# EAGLE board Adapter (EAGLE 6.4)
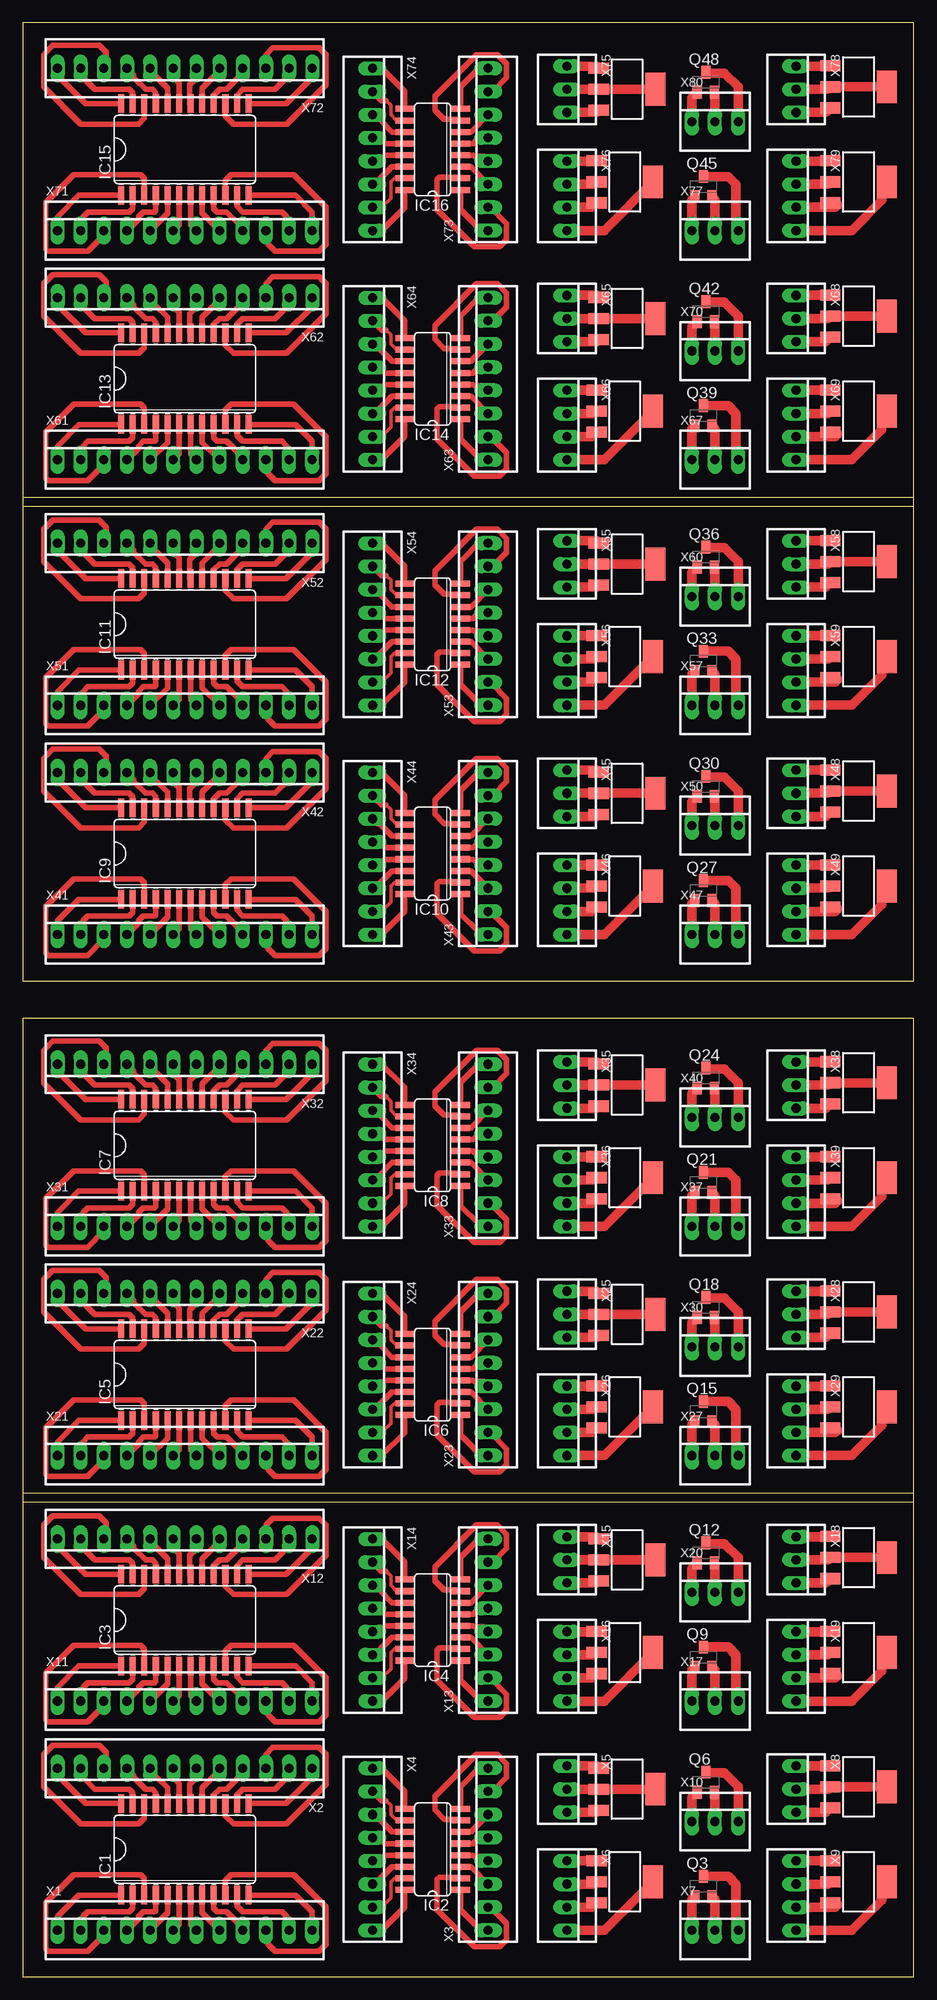
[diagram p8: board, top side]

Size 97.77 x 214.3 mm. Coordinates in mm from the lower left corner, seen from the top.
Outline: 0,0 97.77,0 97.77,53.01 0,53.01 0,0
Outline: 0,52.07 97.77,52.07 97.77,105.08 0,105.08 0,52.07
Outline: 0,109.22 97.77,109.22 97.77,162.23 0,162.23 0,109.22
Outline: 0,161.29 97.77,161.29 97.77,214.3 0,214.3 0,161.29
Copper layers (1*16): Top 0.035mm / dielectric 1.5mm / Bottom 0.035mm
Design rules "default": minimum track width 10mil, minimum drill 24mil, track to track 8mil, track to pad 8mil, pad to pad 8mil, via to via 8mil, smd to smd 8mil, copper to edge 40mil, drill to drill 8mil, minimum pad ring 10mil, minimum via ring 8mil, stop-mask expansion 4mil, vias tented up to drill 0mil, thermal gap 10mil

## Footprints (pad centres in the part's own frame; a part is rotated, then mirrored left to right if it is on the bottom)
SO24W = smd 0.66 x 2.032: 1 -6.985,-5.029; 2 -5.715,-5.029; 3 -4.445,-5.029; 4 -3.175,-5.029; 5 -1.905,-5.029; 6 -0.635,-5.029; 7 0.635,-5.029; 8 1.905,-5.029; 9 3.175,-5.029; 10 4.445,-5.029; 11 5.715,-5.029; 12 6.985,-5.029; 13 6.985,5.029; 14 5.715,5.029; 15 4.445,5.029; 16 3.175,5.029; 17 1.905,5.029; 18 0.635,5.029; 19 -0.635,5.029; 20 -1.905,5.029; 21 -3.175,5.029; 22 -4.445,5.029; 23 -5.715,5.029; 24 -6.985,5.029
SO16 = smd 0.66 x 2.032: 1 -4.445,-3.073; 2 -3.175,-3.073; 3 -1.905,-3.073; 4 -0.635,-3.073; 5 0.635,-3.073; 6 1.905,-3.073; 7 3.175,-3.073; 8 4.445,-3.073; 9 4.445,3.073; 10 3.175,3.073; 11 1.905,3.073; 12 0.635,3.073; 13 -0.635,3.073; 14 -1.905,3.073; 15 -3.175,3.073; 16 -4.445,3.073
SOT223 = smd 1.219 x 2.235: 1 -2.311,-3.099; 2 0,-3.099; 3 2.311,-3.099 | smd 3.6 x 2.2: 4 0,3.099
SOT23-BEC = smd 1 x 1.4: B -0.95,-1.1; C 0,1.1; E 0.95,-1.1
22-23-2121 = drill 1 long: 1 -13.97,0; 2 -11.43,0; 3 -8.89,0; 4 -6.35,0; 5 -3.81,0; 6 -1.27,0; 7 1.27,0; 8 3.81,0; 9 6.35,0; 10 8.89,0; 11 11.43,0; 12 13.97,0
22-23-2081 = drill 1 long: 1 -8.89,0; 2 -6.35,0; 3 -3.81,0; 4 -1.27,0; 5 1.27,0; 6 3.81,0; 7 6.35,0; 8 8.89,0
22-23-2031 = drill 1 long: 1 -2.54,0; 2 0,0; 3 2.54,0
22-23-2041 = drill 1 long: 1 -3.81,0; 2 -1.27,0; 3 1.27,0; 4 3.81,0

## Placement (x,y rotation side)
IC1  4067D  [SO24W]  17.78,13.97 0 top
IC2  ULN2004AD  [SO16]  44.96,13.97 90 top
IC3  4067D  [SO24W]  17.78,39.12 0 top
IC4  ULN2004AD  [SO16]  44.96,39.12 90 top
IC5  4067D  [SO24W]  17.78,66.04 0 top
IC6  ULN2004AD  [SO16]  44.96,66.04 90 top
IC7  4067D  [SO24W]  17.78,91.19 0 top
IC8  ULN2004AD  [SO16]  44.96,91.19 90 top
IC9  4067D  [SO24W]  17.78,123.19 0 top
IC10  ULN2004AD  [SO16]  44.96,123.19 90 top
IC11  4067D  [SO24W]  17.78,148.34 0 top
IC12  ULN2004AD  [SO16]  44.96,148.34 90 top
IC13  4067D  [SO24W]  17.78,175.26 0 top
IC14  ULN2004AD  [SO16]  44.96,175.26 90 top
IC15  4067D  [SO24W]  17.78,200.41 0 top
IC16  ULN2004AD  [SO16]  44.96,200.41 90 top
Q1  BCP53T1  [SOT223]  66.29,20.57 270 top
Q2  BSP452T1  [SOT223]  66.04,10.41 270 top
Q3  BC818-16SMD  [SOT23-BEC]  74.68,9.91 0 top
Q4  BCP53T1  [SOT223]  91.69,20.83 270 top
Q5  BSP452T1  [SOT223]  91.69,10.41 270 top
Q6  BC818-16SMD  [SOT23-BEC]  74.93,21.34 0 top
Q7  BCP53T1  [SOT223]  66.29,45.72 270 top
Q8  BSP452T1  [SOT223]  66.04,35.56 270 top
Q9  BC818-16SMD  [SOT23-BEC]  74.68,35.05 0 top
Q10  BCP53T1  [SOT223]  91.69,45.97 270 top
Q11  BSP452T1  [SOT223]  91.69,35.56 270 top
Q12  BC818-16SMD  [SOT23-BEC]  74.93,46.48 0 top
Q13  BCP53T1  [SOT223]  66.29,72.64 270 top
Q14  BSP452T1  [SOT223]  66.04,62.48 270 top
Q15  BC818-16SMD  [SOT23-BEC]  74.68,61.98 0 top
Q16  BCP53T1  [SOT223]  91.69,72.9 270 top
Q17  BSP452T1  [SOT223]  91.69,62.48 270 top
Q18  BC818-16SMD  [SOT23-BEC]  74.93,73.41 0 top
Q19  BCP53T1  [SOT223]  66.29,97.79 270 top
Q20  BSP452T1  [SOT223]  66.04,87.63 270 top
Q21  BC818-16SMD  [SOT23-BEC]  74.68,87.12 0 top
Q22  BCP53T1  [SOT223]  91.69,98.04 270 top
Q23  BSP452T1  [SOT223]  91.69,87.63 270 top
Q24  BC818-16SMD  [SOT23-BEC]  74.93,98.55 0 top
Q25  BCP53T1  [SOT223]  66.29,129.79 270 top
Q26  BSP452T1  [SOT223]  66.04,119.63 270 top
Q27  BC818-16SMD  [SOT23-BEC]  74.68,119.13 0 top
Q28  BCP53T1  [SOT223]  91.69,130.05 270 top
Q29  BSP452T1  [SOT223]  91.69,119.63 270 top
Q30  BC818-16SMD  [SOT23-BEC]  74.93,130.56 0 top
Q31  BCP53T1  [SOT223]  66.29,154.94 270 top
Q32  BSP452T1  [SOT223]  66.04,144.78 270 top
Q33  BC818-16SMD  [SOT23-BEC]  74.68,144.27 0 top
Q34  BCP53T1  [SOT223]  91.69,155.19 270 top
Q35  BSP452T1  [SOT223]  91.69,144.78 270 top
Q36  BC818-16SMD  [SOT23-BEC]  74.93,155.7 0 top
Q37  BCP53T1  [SOT223]  66.29,181.86 270 top
Q38  BSP452T1  [SOT223]  66.04,171.7 270 top
Q39  BC818-16SMD  [SOT23-BEC]  74.68,171.2 0 top
Q40  BCP53T1  [SOT223]  91.69,182.12 270 top
Q41  BSP452T1  [SOT223]  91.69,171.7 270 top
Q42  BC818-16SMD  [SOT23-BEC]  74.93,182.63 0 top
Q43  BCP53T1  [SOT223]  66.29,207.01 270 top
Q44  BSP452T1  [SOT223]  66.04,196.85 270 top
Q45  BC818-16SMD  [SOT23-BEC]  74.68,196.34 0 top
Q46  BCP53T1  [SOT223]  91.69,207.26 270 top
Q47  BSP452T1  [SOT223]  91.69,196.85 270 top
Q48  BC818-16SMD  [SOT23-BEC]  74.93,207.77 0 top
X1  22-23-2121  [22-23-2121]  17.78,5.08 0 top
X2  22-23-2121  [22-23-2121]  17.78,22.86 180 top
X3  22-23-2081  [22-23-2081]  51.05,13.97 90 top
X4  22-23-2081  [22-23-2081]  38.35,13.97 270 top
X5  22-23-2031  [22-23-2031]  59.69,20.57 270 top
X6  22-23-2041  [22-23-2041]  59.69,8.89 270 top
X7  22-23-2031  [22-23-2031]  75.95,5.08 0 top
X8  22-23-2031  [22-23-2031]  84.84,20.57 270 top
X9  22-23-2041  [22-23-2041]  84.84,8.89 270 top
X10  22-23-2031  [22-23-2031]  75.95,17.02 0 top
X11  22-23-2121  [22-23-2121]  17.78,30.23 0 top
X12  22-23-2121  [22-23-2121]  17.78,48.01 180 top
X13  22-23-2081  [22-23-2081]  51.05,39.12 90 top
X14  22-23-2081  [22-23-2081]  38.35,39.12 270 top
X15  22-23-2031  [22-23-2031]  59.69,45.72 270 top
X16  22-23-2041  [22-23-2041]  59.69,34.04 270 top
X17  22-23-2031  [22-23-2031]  75.95,30.23 0 top
X18  22-23-2031  [22-23-2031]  84.84,45.72 270 top
X19  22-23-2041  [22-23-2041]  84.84,34.04 270 top
X20  22-23-2031  [22-23-2031]  75.95,42.16 0 top
X21  22-23-2121  [22-23-2121]  17.78,57.15 0 top
X22  22-23-2121  [22-23-2121]  17.78,74.93 180 top
X23  22-23-2081  [22-23-2081]  51.05,66.04 90 top
X24  22-23-2081  [22-23-2081]  38.35,66.04 270 top
X25  22-23-2031  [22-23-2031]  59.69,72.64 270 top
X26  22-23-2041  [22-23-2041]  59.69,60.96 270 top
X27  22-23-2031  [22-23-2031]  75.95,57.15 0 top
X28  22-23-2031  [22-23-2031]  84.84,72.64 270 top
X29  22-23-2041  [22-23-2041]  84.84,60.96 270 top
X30  22-23-2031  [22-23-2031]  75.95,69.09 0 top
X31  22-23-2121  [22-23-2121]  17.78,82.3 0 top
X32  22-23-2121  [22-23-2121]  17.78,100.08 180 top
X33  22-23-2081  [22-23-2081]  51.05,91.19 90 top
X34  22-23-2081  [22-23-2081]  38.35,91.19 270 top
X35  22-23-2031  [22-23-2031]  59.69,97.79 270 top
X36  22-23-2041  [22-23-2041]  59.69,86.11 270 top
X37  22-23-2031  [22-23-2031]  75.95,82.3 0 top
X38  22-23-2031  [22-23-2031]  84.84,97.79 270 top
X39  22-23-2041  [22-23-2041]  84.84,86.11 270 top
X40  22-23-2031  [22-23-2031]  75.95,94.23 0 top
X41  22-23-2121  [22-23-2121]  17.78,114.3 0 top
X42  22-23-2121  [22-23-2121]  17.78,132.08 180 top
X43  22-23-2081  [22-23-2081]  51.05,123.19 90 top
X44  22-23-2081  [22-23-2081]  38.35,123.19 270 top
X45  22-23-2031  [22-23-2031]  59.69,129.79 270 top
X46  22-23-2041  [22-23-2041]  59.69,118.11 270 top
X47  22-23-2031  [22-23-2031]  75.95,114.3 0 top
X48  22-23-2031  [22-23-2031]  84.84,129.79 270 top
X49  22-23-2041  [22-23-2041]  84.84,118.11 270 top
X50  22-23-2031  [22-23-2031]  75.95,126.24 0 top
X51  22-23-2121  [22-23-2121]  17.78,139.45 0 top
X52  22-23-2121  [22-23-2121]  17.78,157.23 180 top
X53  22-23-2081  [22-23-2081]  51.05,148.34 90 top
X54  22-23-2081  [22-23-2081]  38.35,148.34 270 top
X55  22-23-2031  [22-23-2031]  59.69,154.94 270 top
X56  22-23-2041  [22-23-2041]  59.69,143.26 270 top
X57  22-23-2031  [22-23-2031]  75.95,139.45 0 top
X58  22-23-2031  [22-23-2031]  84.84,154.94 270 top
X59  22-23-2041  [22-23-2041]  84.84,143.26 270 top
X60  22-23-2031  [22-23-2031]  75.95,151.38 0 top
X61  22-23-2121  [22-23-2121]  17.78,166.37 0 top
X62  22-23-2121  [22-23-2121]  17.78,184.15 180 top
X63  22-23-2081  [22-23-2081]  51.05,175.26 90 top
X64  22-23-2081  [22-23-2081]  38.35,175.26 270 top
X65  22-23-2031  [22-23-2031]  59.69,181.86 270 top
X66  22-23-2041  [22-23-2041]  59.69,170.18 270 top
X67  22-23-2031  [22-23-2031]  75.95,166.37 0 top
X68  22-23-2031  [22-23-2031]  84.84,181.86 270 top
X69  22-23-2041  [22-23-2041]  84.84,170.18 270 top
X70  22-23-2031  [22-23-2031]  75.95,178.31 0 top
X71  22-23-2121  [22-23-2121]  17.78,191.52 0 top
X72  22-23-2121  [22-23-2121]  17.78,209.3 180 top
X73  22-23-2081  [22-23-2081]  51.05,200.41 90 top
X74  22-23-2081  [22-23-2081]  38.35,200.41 270 top
X75  22-23-2031  [22-23-2031]  59.69,207.01 270 top
X76  22-23-2041  [22-23-2041]  59.69,195.33 270 top
X77  22-23-2031  [22-23-2031]  75.95,191.52 0 top
X78  22-23-2031  [22-23-2031]  84.84,207.01 270 top
X79  22-23-2041  [22-23-2041]  84.84,195.33 270 top
X80  22-23-2031  [22-23-2031]  75.95,203.45 0 top

## Tracks (layer width: path | path; a pad name or v marks a point on that pad's centre or on a via)
N$1
  Top 0.61: IC1.2 12.07,7.49 11.68,7.11 7.11,7.11 6.6,6.6 6.6,5.33 X1.2
N$2
  Top 0.61: IC1.1 6.15,8.94 3.81,6.6 X1.1
N$3
  Top 0.61: IC1.3 13.34,10.79 12.95,11.18 5.59,11.18 2.54,8.13 2.54,3.05 2.79,2.79 7.11,2.79 8.89,4.57 X1.3
N$4
  Top 0.61: IC1.4 14.61,7.24 14.48,7.11 13.21,7.11 12.7,6.6 12.7,6.35 X1.4
N$5
  Top 0.61: IC1.5 15.88,6.99 X1.5
N$6
  Top 0.61: IC1.6 17.14,5.71 X1.6
N$7
  Top 0.61: IC1.7 18.41,5.71 X1.7
N$8
  Top 0.61: IC1.8 19.68,6.99 X1.8
N$9
  Top 0.61: IC1.9 20.95,7.49 21.34,7.11 22.35,7.11 23.88,5.59 23.88,5.33 X1.9
N$10
  Top 0.61: IC1.10 22.22,10.54 22.86,11.18 29.72,11.18 33.27,7.62 33.27,3.56 32.51,2.79 27.69,2.79 26.92,3.56 26.92,4.83 X1.10
N$11
  Top 0.61: IC1.11 23.49,7.75 24.13,7.11 28.45,7.11 28.96,6.6 28.96,5.33 X1.11
N$12
  Top 0.61: IC1.16 20.95,19.94 21.59,20.57 22.35,20.57 23.88,22.1 23.88,22.61 X2.4
N$13
  Top 0.61: IC1.17 19.68,20.7 21.34,22.35 21.34,22.61 X2.5
N$14
  Top 0.61: IC1.18 18.29,19 18.29,21.08 19.05,21.84 X2.6
N$15
  Top 0.61: IC1.19 17.14,21.21 16.51,21.84 X2.7
N$16
  Top 0.61: IC1.20 15.88,20.7 14.48,22.1 14.48,22.35 X2.8
N$17
  Top 0.61: IC1.21 14.61,20.19 14.22,20.57 13.46,20.57 12.19,21.84 12.19,22.1 X2.9
N$18
  Top 0.61: IC1.22 13.34,17.4 12.7,16.76 6.35,16.76 2.29,20.83 2.29,24.38 3.3,25.4 8.38,25.4 9.14,24.64 9.14,23.11 X2.10
N$19
  Top 0.61: IC1.23 12.07,20.19 11.68,20.57 7.87,20.57 6.6,21.84 6.6,22.61 X2.11
N$20
  Top 0.61: IC1.12 29.92,8.94 31.75,7.11 X1.12
N$21
  Top 0.61: IC1.24 6.91,19 4.06,21.84 4.06,22.61 X2.12
N$22
  Top 0.61: IC1.15 22.22,17.65 23.11,16.76 28.96,16.76 33.27,21.08 33.27,24.38 32.51,25.15 27.43,25.15 26.67,24.38 X2.3
N$23
  Top 0.61: IC1.14 23.49,19.94 24.13,20.57 27.69,20.57 29.21,22.1 X2.2
N$24
  Top 0.61: IC1.13 28.9,19 31.75,21.84 X2.1
N$25
  Top 0.61: IC2.1 48.03,7.34 50.04,5.33 50.8,5.33 X3.1
N$26
  Top 0.61: X3.2 51.31,7.62 53.09,5.84 53.09,4.06 52.32,3.3 49.53,3.3 45.47,7.37 45.47,10.67 45.72,10.92 47.9,10.92 IC2.2
N$27
  Top 0.61: IC2.3 49.15,12.07 X3.3
N$28
  Top 0.61: IC2.4 49.4,13.34 49.53,13.21 50.55,13.21 X3.4
N$29
  Top 0.61: IC2.5 49.4,14.61 50.04,15.24 X3.5
N$30
  Top 0.61: IC2.6 49.15,15.88 X3.6
N$31
  Top 0.61: X3.7 51.56,20.32 53.09,21.84 53.09,23.37 52.07,24.38 49.78,24.38 45.21,19.81 45.21,18.29 46.23,17.27 47.9,17.27 IC2.7
N$32
  Top 0.61: IC2.8 48.03,20.85 50.29,23.11 50.8,23.11 X3.8
N$33
  Top 0.61: IC2.9 41.89,20.34 39.37,22.86 X4.1
N$34
  Top 0.406: IC2.10 41.02,17.14 40.39,17.78 40.39,18.8 39.88,19.3
  Top 0.61: 39.88,19.3 39.37,19.3 X4.2
N$35
  Top 0.61: IC2.11 40.51,15.88 39.12,17.27 38.86,17.27 X4.3
N$36
  Top 0.61: IC2.12 39.75,14.61 39.12,15.24 X4.4
N$37
  Top 0.61: IC2.13 39.75,13.34 39.12,12.7 X4.5
N$38
  Top 0.61: IC2.14 40.51,12.07 38.86,10.41 38.61,10.41 X4.6
N$39
  Top 0.406: IC2.15 40.77,10.79 40.39,10.41 40.39,8.64 39.37,7.62 X4.7
N$40
  Top 0.61: IC2.16 41.89,7.6 39.37,5.08 X4.8
N$41
  Top 1.016: X5.1 62.97,23.11 Q1.1
N$42
  Top 1.016: X5.3 62.97,18.03 Q1.3
N$43
  Top 1.016: X5.2 Q1.2
N$44
  Top 1.016: X6.1 62.92,12.7 Q2.1
N$45
  Top 1.016: X6.2 62.69,10.16 Q2.2
N$46
  Top 1.016: X6.3 62.46,7.62 Q2.3
N$47
  Top 1.016: X6.4 63.8,5.08 Q2.4
N$48
  Top 1.016: X7.1 73.41,8.49 Q3.B
N$49
  Top 1.016: X7.2 75.95,8.49 Q3.E
N$50
  Top 1.016: Q3.C 77.39,11.01 78.23,10.16 78.23,5.33 X7.3
N$51
  Top 1.016: X8.1 88.57,23.11 Q4.1
N$52
  Top 1.016: X8.2 88.34,20.57 Q4.2
N$53
  Top 1.016: X8.3 88.11,18.03 Q4.3
N$54
  Top 1.016: X9.1 88.57,12.7 Q5.1
N$55
  Top 1.016: X9.2 88.34,10.16 Q5.2
N$56
  Top 1.016: X9.3 89.15,7.62 89.41,7.87 88.82,7.87 Q5.3
N$57
  Top 1.016: X9.4 90.93,5.08 94.23,8.38 94.23,9.86 Q5.4
N$58
  Top 1.016: X10.1 73.41,19.66 Q6.B
N$59
  Top 1.016: X10.2 75.95,20.17 Q6.E
N$60
  Top 1.016: X10.3 78.49,20.83 76.96,22.35 75.01,22.35 Q6.C
N$61
  Top 1.016: 63.75,20.57 69.09,20.57
N$62
  Top 1.016: 89.15,20.83 95,20.83
N$63
  Top 0.61: IC3.2 12.07,32.64 11.68,32.26 7.11,32.26 6.6,31.75 6.6,30.48 X11.2
N$64
  Top 0.61: IC3.1 6.15,34.09 3.81,31.75 X11.1
N$65
  Top 0.61: IC3.3 13.34,35.94 12.95,36.32 5.59,36.32 2.54,33.27 2.54,28.19 2.79,27.94 7.11,27.94 8.89,29.72 X11.3
N$66
  Top 0.61: IC3.4 14.61,32.38 14.48,32.26 13.21,32.26 12.7,31.75 12.7,31.5 X11.4
N$67
  Top 0.61: IC3.5 15.88,32.13 X11.5
N$68
  Top 0.61: IC3.6 17.14,30.86 X11.6
N$69
  Top 0.61: IC3.7 18.41,30.86 X11.7
N$70
  Top 0.61: IC3.8 19.68,32.13 X11.8
N$71
  Top 0.61: IC3.9 20.95,32.64 21.34,32.26 22.35,32.26 23.88,30.73 23.88,30.48 X11.9
N$72
  Top 0.61: IC3.10 22.22,35.69 22.86,36.32 29.72,36.32 33.27,32.77 33.27,28.7 32.51,27.94 27.69,27.94 26.92,28.7 26.92,29.97 X11.10
N$73
  Top 0.61: IC3.11 23.49,32.89 24.13,32.26 28.45,32.26 28.96,31.75 28.96,30.48 X11.11
N$74
  Top 0.61: IC3.16 20.95,45.09 21.59,45.72 22.35,45.72 23.88,47.24 23.88,47.75 X12.4
N$75
  Top 0.61: IC3.17 19.68,45.85 21.34,47.5 21.34,47.75 X12.5
N$76
  Top 0.61: IC3.18 18.29,44.14 18.29,46.23 19.05,46.99 X12.6
N$77
  Top 0.61: IC3.19 17.14,46.35 16.51,46.99 X12.7
N$78
  Top 0.61: IC3.20 15.88,45.85 14.48,47.24 14.48,47.5 X12.8
N$79
  Top 0.61: IC3.21 14.61,45.34 14.22,45.72 13.46,45.72 12.19,46.99 12.19,47.24 X12.9
N$80
  Top 0.61: IC3.22 13.34,42.55 12.7,41.91 6.35,41.91 2.29,45.97 2.29,49.53 3.3,50.55 8.38,50.55 9.14,49.78 9.14,48.26 X12.10
N$81
  Top 0.61: IC3.23 12.07,45.34 11.68,45.72 7.87,45.72 6.6,46.99 6.6,47.75 X12.11
N$82
  Top 0.61: IC3.12 29.92,34.09 31.75,32.26 X11.12
N$83
  Top 0.61: IC3.24 6.91,44.14 4.06,46.99 4.06,47.75 X12.12
N$84
  Top 0.61: IC3.15 22.22,42.8 23.11,41.91 28.96,41.91 33.27,46.23 33.27,49.53 32.51,50.29 27.43,50.29 26.67,49.53 X12.3
N$85
  Top 0.61: IC3.14 23.49,45.09 24.13,45.72 27.69,45.72 29.21,47.24 X12.2
N$86
  Top 0.61: IC3.13 28.9,44.14 31.75,46.99 X12.1
N$87
  Top 0.61: IC4.1 48.03,32.49 50.04,30.48 50.8,30.48 X13.1
N$88
  Top 0.61: X13.2 51.31,32.77 53.09,30.99 53.09,29.21 52.32,28.45 49.53,28.45 45.47,32.51 45.47,35.81 45.72,36.07 47.9,36.07 IC4.2
N$89
  Top 0.61: IC4.3 49.15,37.21 X13.3
N$90
  Top 0.61: IC4.4 49.4,38.48 49.53,38.35 50.55,38.35 X13.4
N$91
  Top 0.61: IC4.5 49.4,39.75 50.04,40.39 X13.5
N$92
  Top 0.61: IC4.6 49.15,41.02 X13.6
N$93
  Top 0.61: X13.7 51.56,45.47 53.09,46.99 53.09,48.51 52.07,49.53 49.78,49.53 45.21,44.96 45.21,43.43 46.23,42.42 47.9,42.42 IC4.7
N$94
  Top 0.61: IC4.8 48.03,46 50.29,48.26 50.8,48.26 X13.8
N$95
  Top 0.61: IC4.9 41.89,45.49 39.37,48.01 X14.1
N$96
  Top 0.406: IC4.10 41.02,42.29 40.39,42.93 40.39,43.94 39.88,44.45
  Top 0.61: 39.88,44.45 39.37,44.45 X14.2
N$97
  Top 0.61: IC4.11 40.51,41.02 39.12,42.42 38.86,42.42 X14.3
N$98
  Top 0.61: IC4.12 39.75,39.75 39.12,40.39 X14.4
N$99
  Top 0.61: IC4.13 39.75,38.48 39.12,37.85 X14.5
N$100
  Top 0.61: IC4.14 40.51,37.21 38.86,35.56 38.61,35.56 X14.6
N$101
  Top 0.406: IC4.15 40.77,35.94 40.39,35.56 40.39,33.78 39.37,32.77 X14.7
N$102
  Top 0.61: IC4.16 41.89,32.74 39.37,30.23 X14.8
N$103
  Top 1.016: X15.1 62.97,48.26 Q7.1
N$104
  Top 1.016: X15.2 Q7.2
N$105
  Top 1.016: X15.3 62.97,43.18 Q7.3
N$106
  Top 1.016: X16.1 62.92,37.85 Q8.1
N$107
  Top 1.016: X16.2 62.69,35.31 Q8.2
N$108
  Top 1.016: X16.3 62.46,32.77 Q8.3
N$109
  Top 1.016: X16.4 63.8,30.23 Q8.4
N$110
  Top 1.016: X17.1 73.41,33.63 Q9.B
N$111
  Top 1.016: X17.2 75.95,33.63 Q9.E
N$112
  Top 1.016: Q9.C 77.39,36.15 78.23,35.31 78.23,30.48 X17.3
N$113
  Top 1.016: X18.1 88.57,48.26 Q10.1
N$114
  Top 1.016: X18.2 88.34,45.72 Q10.2
N$115
  Top 1.016: X18.3 88.11,43.18 Q10.3
N$116
  Top 1.016: X19.1 88.57,37.85 Q11.1
N$117
  Top 1.016: X19.2 88.34,35.31 Q11.2
N$118
  Top 1.016: X19.3 89.15,32.77 89.41,33.02 88.82,33.02 Q11.3
N$119
  Top 1.016: X19.4 90.93,30.23 94.23,33.53 94.23,35 Q11.4
N$120
  Top 1.016: X20.1 73.41,44.81 Q12.B
N$121
  Top 1.016: X20.2 75.95,45.32 Q12.E
N$122
  Top 1.016: X20.3 78.49,45.97 76.96,47.5 75.01,47.5 Q12.C
N$123
  Top 1.016: 63.75,45.72 69.09,45.72
N$124
  Top 1.016: 89.15,45.97 95,45.97
N$125
  Top 0.61: IC5.2 12.07,59.56 11.68,59.18 7.11,59.18 6.6,58.67 6.6,57.4 X21.2
N$126
  Top 0.61: IC5.1 6.15,61.01 3.81,58.67 X21.1
N$127
  Top 0.61: IC5.3 13.34,62.86 12.95,63.25 5.59,63.25 2.54,60.2 2.54,55.12 2.79,54.86 7.11,54.86 8.89,56.64 X21.3
N$128
  Top 0.61: IC5.4 14.61,59.31 14.48,59.18 13.21,59.18 12.7,58.67 12.7,58.42 X21.4
N$129
  Top 0.61: IC5.5 15.88,59.05 X21.5
N$130
  Top 0.61: IC5.6 17.14,57.78 X21.6
N$131
  Top 0.61: IC5.7 18.41,57.78 X21.7
N$132
  Top 0.61: IC5.8 19.68,59.05 X21.8
N$133
  Top 0.61: IC5.9 20.95,59.56 21.34,59.18 22.35,59.18 23.88,57.66 23.88,57.4 X21.9
N$134
  Top 0.61: IC5.10 22.22,62.61 22.86,63.25 29.72,63.25 33.27,59.69 33.27,55.63 32.51,54.86 27.69,54.86 26.92,55.63 26.92,56.9 X21.10
N$135
  Top 0.61: IC5.11 23.49,59.82 24.13,59.18 28.45,59.18 28.96,58.67 28.96,57.4 X21.11
N$136
  Top 0.61: IC5.16 20.95,72.01 21.59,72.64 22.35,72.64 23.88,74.17 23.88,74.68 X22.4
N$137
  Top 0.61: IC5.17 19.68,72.77 21.34,74.42 21.34,74.68 X22.5
N$138
  Top 0.61: IC5.18 18.29,71.07 18.29,73.15 19.05,73.91 X22.6
N$139
  Top 0.61: IC5.19 17.14,73.28 16.51,73.91 X22.7
N$140
  Top 0.61: IC5.20 15.88,72.77 14.48,74.17 14.48,74.42 X22.8
N$141
  Top 0.61: IC5.21 14.61,72.26 14.22,72.64 13.46,72.64 12.19,73.91 12.19,74.17 X22.9
N$142
  Top 0.61: IC5.22 13.34,69.47 12.7,68.83 6.35,68.83 2.29,72.9 2.29,76.45 3.3,77.47 8.38,77.47 9.14,76.71 9.14,75.18 X22.10
N$143
  Top 0.61: IC5.23 12.07,72.26 11.68,72.64 7.87,72.64 6.6,73.91 6.6,74.68 X22.11
N$144
  Top 0.61: IC5.12 29.92,61.01 31.75,59.18 X21.12
N$145
  Top 0.61: IC5.24 6.91,71.07 4.06,73.91 4.06,74.68 X22.12
N$146
  Top 0.61: IC5.15 22.22,69.72 23.11,68.83 28.96,68.83 33.27,73.15 33.27,76.45 32.51,77.22 27.43,77.22 26.67,76.45 X22.3
N$147
  Top 0.61: IC5.14 23.49,72.01 24.13,72.64 27.69,72.64 29.21,74.17 X22.2
N$148
  Top 0.61: IC5.13 28.9,71.07 31.75,73.91 X22.1
N$149
  Top 0.61: IC6.1 48.03,59.41 50.04,57.4 50.8,57.4 X23.1
N$150
  Top 0.61: X23.2 51.31,59.69 53.09,57.91 53.09,56.13 52.32,55.37 49.53,55.37 45.47,59.44 45.47,62.74 45.72,62.99 47.9,62.99 IC6.2
N$151
  Top 0.61: IC6.3 49.15,64.14 X23.3
N$152
  Top 0.61: IC6.4 49.4,65.41 49.53,65.28 50.55,65.28 X23.4
N$153
  Top 0.61: IC6.5 49.4,66.67 50.04,67.31 X23.5
N$154
  Top 0.61: IC6.6 49.15,67.95 X23.6
N$155
  Top 0.61: X23.7 51.56,72.39 53.09,73.91 53.09,75.44 52.07,76.45 49.78,76.45 45.21,71.88 45.21,70.36 46.23,69.34 47.9,69.34 IC6.7
N$156
  Top 0.61: IC6.8 48.03,72.92 50.29,75.18 50.8,75.18 X23.8
N$157
  Top 0.61: IC6.9 41.89,72.41 39.37,74.93 X24.1
N$158
  Top 0.406: IC6.10 41.02,69.22 40.39,69.85 40.39,70.87 39.88,71.37
  Top 0.61: 39.88,71.37 39.37,71.37 X24.2
N$159
  Top 0.61: IC6.11 40.51,67.95 39.12,69.34 38.86,69.34 X24.3
N$160
  Top 0.61: IC6.12 39.75,66.67 39.12,67.31 X24.4
N$161
  Top 0.61: IC6.13 39.75,65.41 39.12,64.77 X24.5
N$162
  Top 0.61: IC6.14 40.51,64.14 38.86,62.48 38.61,62.48 X24.6
N$163
  Top 0.406: IC6.15 40.77,62.86 40.39,62.48 40.39,60.71 39.37,59.69 X24.7
N$164
  Top 0.61: IC6.16 41.89,59.66 39.37,57.15 X24.8
N$165
  Top 1.016: X25.1 62.97,75.18 Q13.1
N$166
  Top 1.016: X25.2 Q13.2
N$167
  Top 1.016: X25.3 62.97,70.1 Q13.3
N$168
  Top 1.016: X26.1 62.92,64.77 Q14.1
N$169
  Top 1.016: X26.2 62.69,62.23 Q14.2
N$170
  Top 1.016: X26.3 62.46,59.69 Q14.3
N$171
  Top 1.016: X26.4 63.8,57.15 Q14.4
N$172
  Top 1.016: X27.1 73.41,60.56 Q15.B
N$173
  Top 1.016: X27.2 75.95,60.56 Q15.E
N$174
  Top 1.016: Q15.C 77.39,63.08 78.23,62.23 78.23,57.4 X27.3
N$175
  Top 1.016: X28.1 88.57,75.18 Q16.1
N$176
  Top 1.016: X28.2 88.34,72.64 Q16.2
N$177
  Top 1.016: X28.3 88.11,70.1 Q16.3
N$178
  Top 1.016: X29.1 88.57,64.77 Q17.1
N$179
  Top 1.016: X29.2 88.34,62.23 Q17.2
N$180
  Top 1.016: X29.3 89.15,59.69 89.41,59.94 88.82,59.94 Q17.3
N$181
  Top 1.016: X29.4 90.93,57.15 94.23,60.45 94.23,61.92 Q17.4
N$182
  Top 1.016: X30.1 73.41,71.73 Q18.B
N$183
  Top 1.016: X30.2 75.95,72.24 Q18.E
N$184
  Top 1.016: X30.3 78.49,72.9 76.96,74.42 75.01,74.42 Q18.C
N$185
  Top 0.61: IC7.2 12.07,84.71 11.68,84.33 7.11,84.33 6.6,83.82 6.6,82.55 X31.2
N$186
  Top 0.61: IC7.1 6.15,86.16 3.81,83.82 X31.1
N$187
  Top 0.61: IC7.3 13.34,88.01 12.95,88.39 5.59,88.39 2.54,85.34 2.54,80.26 2.79,80.01 7.11,80.01 8.89,81.79 X31.3
N$188
  Top 0.61: IC7.4 14.61,84.45 14.48,84.33 13.21,84.33 12.7,83.82 12.7,83.57 X31.4
N$189
  Top 0.61: IC7.5 15.88,84.2 X31.5
N$190
  Top 0.61: IC7.6 17.14,82.93 X31.6
N$191
  Top 0.61: IC7.7 18.41,82.93 X31.7
N$192
  Top 0.61: IC7.8 19.68,84.2 X31.8
N$193
  Top 0.61: IC7.9 20.95,84.71 21.34,84.33 22.35,84.33 23.88,82.8 23.88,82.55 X31.9
N$194
  Top 0.61: IC7.10 22.22,87.76 22.86,88.39 29.72,88.39 33.27,84.84 33.27,80.77 32.51,80.01 27.69,80.01 26.92,80.77 26.92,82.04 X31.10
N$195
  Top 0.61: IC7.11 23.49,84.96 24.13,84.33 28.45,84.33 28.96,83.82 28.96,82.55 X31.11
N$196
  Top 0.61: IC7.16 20.95,97.16 21.59,97.79 22.35,97.79 23.88,99.31 23.88,99.82 X32.4
N$197
  Top 0.61: IC7.17 19.68,97.92 21.34,99.57 21.34,99.82 X32.5
N$198
  Top 0.61: IC7.18 18.29,96.22 18.29,98.3 19.05,99.06 X32.6
N$199
  Top 0.61: IC7.19 17.14,98.42 16.51,99.06 X32.7
N$200
  Top 0.61: IC7.20 15.88,97.92 14.48,99.31 14.48,99.57 X32.8
N$201
  Top 0.61: IC7.21 14.61,97.41 14.22,97.79 13.46,97.79 12.19,99.06 12.19,99.31 X32.9
N$202
  Top 0.61: IC7.22 13.34,94.61 12.7,93.98 6.35,93.98 2.29,98.04 2.29,101.6 3.3,102.62 8.38,102.62 9.14,101.85 9.14,100.33 X32.10
N$203
  Top 0.61: IC7.23 12.07,97.41 11.68,97.79 7.87,97.79 6.6,99.06 6.6,99.82 X32.11
N$204
  Top 0.61: IC7.12 29.92,86.16 31.75,84.33 X31.12
N$205
  Top 0.61: IC7.24 6.91,96.22 4.06,99.06 4.06,99.82 X32.12
N$206
  Top 0.61: IC7.15 22.22,94.87 23.11,93.98 28.96,93.98 33.27,98.3 33.27,101.6 32.51,102.36 27.43,102.36 26.67,101.6 X32.3
N$207
  Top 0.61: IC7.14 23.49,97.16 24.13,97.79 27.69,97.79 29.21,99.31 X32.2
N$208
  Top 0.61: IC7.13 28.9,96.22 31.75,99.06 X32.1
N$209
  Top 0.61: IC8.1 48.03,84.56 50.04,82.55 50.8,82.55 X33.1
N$210
  Top 0.61: X33.2 51.31,84.84 53.09,83.06 53.09,81.28 52.32,80.52 49.53,80.52 45.47,84.58 45.47,87.88 45.72,88.14 47.9,88.14 IC8.2
N$211
  Top 0.61: IC8.3 49.15,89.28 X33.3
N$212
  Top 0.61: IC8.4 49.4,90.55 49.53,90.42 50.55,90.42 X33.4
N$213
  Top 0.61: IC8.5 49.4,91.82 50.04,92.46 X33.5
N$214
  Top 0.61: IC8.6 49.15,93.09 X33.6
N$215
  Top 0.61: X33.7 51.56,97.54 53.09,99.06 53.09,100.58 52.07,101.6 49.78,101.6 45.21,97.03 45.21,95.5 46.23,94.49 47.9,94.49 IC8.7
N$216
  Top 0.61: IC8.8 48.03,98.07 50.29,100.33 50.8,100.33 X33.8
N$217
  Top 0.61: IC8.9 41.89,97.56 39.37,100.08 X34.1
N$218
  Top 0.406: IC8.10 41.02,94.36 40.39,95 40.39,96.01 39.88,96.52
  Top 0.61: 39.88,96.52 39.37,96.52 X34.2
N$219
  Top 0.61: IC8.11 40.51,93.09 39.12,94.49 38.86,94.49 X34.3
N$220
  Top 0.61: IC8.12 39.75,91.82 39.12,92.46 X34.4
N$221
  Top 0.61: IC8.13 39.75,90.55 39.12,89.92 X34.5
N$222
  Top 0.61: IC8.14 40.51,89.28 38.86,87.63 38.61,87.63 X34.6
N$223
  Top 0.406: IC8.15 40.77,88.01 40.39,87.63 40.39,85.85 39.37,84.84 X34.7
N$224
  Top 0.61: IC8.16 41.89,84.81 39.37,82.3 X34.8
N$225
  Top 1.016: X35.1 62.97,100.33 Q19.1
N$226
  Top 1.016: X35.2 Q19.2
N$227
  Top 1.016: X35.3 62.97,95.25 Q19.3
N$228
  Top 1.016: X36.1 62.92,89.92 Q20.1
N$229
  Top 1.016: X36.2 62.69,87.38 Q20.2
N$230
  Top 1.016: X36.3 62.46,84.84 Q20.3
N$231
  Top 1.016: X36.4 63.8,82.3 Q20.4
N$232
  Top 1.016: X37.1 73.41,85.7 Q21.B
N$233
  Top 1.016: X37.2 75.95,85.7 Q21.E
N$234
  Top 1.016: Q21.C 77.39,88.22 78.23,87.38 78.23,82.55 X37.3
N$235
  Top 1.016: X38.1 88.57,100.33 Q22.1
N$236
  Top 1.016: X38.2 88.34,97.79 Q22.2
N$237
  Top 1.016: X38.3 88.11,95.25 Q22.3
N$238
  Top 1.016: X39.1 88.57,89.92 Q23.1
N$239
  Top 1.016: X39.2 88.34,87.38 Q23.2
N$240
  Top 1.016: X39.3 89.15,84.84 89.41,85.09 88.82,85.09 Q23.3
N$241
  Top 1.016: X39.4 90.93,82.3 94.23,85.6 94.23,87.07 Q23.4
N$242
  Top 1.016: X40.1 73.41,96.88 Q24.B
N$243
  Top 1.016: X40.2 75.95,97.39 Q24.E
N$244
  Top 1.016: X40.3 78.49,98.04 76.96,99.57 75.01,99.57 Q24.C
N$245
  Top 1.016: 63.75,72.64 69.09,72.64
N$246
  Top 1.016: 89.15,72.9 95,72.9
N$247
  Top 1.016: 63.75,97.79 69.09,97.79
N$248
  Top 1.016: 89.15,98.04 95,98.04
N$249
  Top 0.61: IC9.2 12.07,116.71 11.68,116.33 7.11,116.33 6.6,115.82 6.6,114.55 X41.2
N$250
  Top 0.61: IC9.1 6.15,118.16 3.81,115.82 X41.1
N$251
  Top 0.61: IC9.3 13.34,120.02 12.95,120.4 5.59,120.4 2.54,117.35 2.54,112.27 2.79,112.01 7.11,112.01 8.89,113.79 X41.3
N$252
  Top 0.61: IC9.4 14.61,116.46 14.48,116.33 13.21,116.33 12.7,115.82 12.7,115.57 X41.4
N$253
  Top 0.61: IC9.5 15.88,116.2 X41.5
N$254
  Top 0.61: IC9.6 17.14,114.94 X41.6
N$255
  Top 0.61: IC9.7 18.41,114.94 X41.7
N$256
  Top 0.61: IC9.8 19.68,116.2 X41.8
N$257
  Top 0.61: IC9.9 20.95,116.71 21.34,116.33 22.35,116.33 23.88,114.81 23.88,114.55 X41.9
N$258
  Top 0.61: IC9.10 22.22,119.76 22.86,120.4 29.72,120.4 33.27,116.84 33.27,112.78 32.51,112.01 27.69,112.01 26.92,112.78 26.92,114.05 X41.10
N$259
  Top 0.61: IC9.11 23.49,116.97 24.13,116.33 28.45,116.33 28.96,115.82 28.96,114.55 X41.11
N$260
  Top 0.61: IC9.16 20.95,129.16 21.59,129.79 22.35,129.79 23.88,131.32 23.88,131.83 X42.4
N$261
  Top 0.61: IC9.17 19.68,129.92 21.34,131.57 21.34,131.83 X42.5
N$262
  Top 0.61: IC9.18 18.29,128.22 18.29,130.3 19.05,131.06 X42.6
N$263
  Top 0.61: IC9.19 17.14,130.43 16.51,131.06 X42.7
N$264
  Top 0.61: IC9.20 15.88,129.92 14.48,131.32 14.48,131.57 X42.8
N$265
  Top 0.61: IC9.21 14.61,129.41 14.22,129.79 13.46,129.79 12.19,131.06 12.19,131.32 X42.9
N$266
  Top 0.61: IC9.22 13.34,126.62 12.7,125.98 6.35,125.98 2.29,130.05 2.29,133.6 3.3,134.62 8.38,134.62 9.14,133.86 9.14,132.33 X42.10
N$267
  Top 0.61: IC9.23 12.07,129.41 11.68,129.79 7.87,129.79 6.6,131.06 6.6,131.83 X42.11
N$268
  Top 0.61: IC9.12 29.92,118.16 31.75,116.33 X41.12
N$269
  Top 0.61: IC9.24 6.91,128.22 4.06,131.06 4.06,131.83 X42.12
N$270
  Top 0.61: IC9.15 22.22,126.87 23.11,125.98 28.96,125.98 33.27,130.3 33.27,133.6 32.51,134.37 27.43,134.37 26.67,133.6 X42.3
N$271
  Top 0.61: IC9.14 23.49,129.16 24.13,129.79 27.69,129.79 29.21,131.32 X42.2
N$272
  Top 0.61: IC9.13 28.9,128.22 31.75,131.06 X42.1
N$273
  Top 0.61: IC10.1 48.03,116.56 50.04,114.55 50.8,114.55 X43.1
N$274
  Top 0.61: X43.2 51.31,116.84 53.09,115.06 53.09,113.28 52.32,112.52 49.53,112.52 45.47,116.59 45.47,119.89 45.72,120.14 47.9,120.14 IC10.2
N$275
  Top 0.61: IC10.3 49.15,121.28 X43.3
N$276
  Top 0.61: IC10.4 49.4,122.55 49.53,122.43 50.55,122.43 X43.4
N$277
  Top 0.61: IC10.5 49.4,123.83 50.04,124.46 X43.5
N$278
  Top 0.61: IC10.6 49.15,125.09 X43.6
N$279
  Top 0.61: X43.7 51.56,129.54 53.09,131.06 53.09,132.59 52.07,133.6 49.78,133.6 45.21,129.03 45.21,127.51 46.23,126.49 47.9,126.49 IC10.7
N$280
  Top 0.61: IC10.8 48.03,130.07 50.29,132.33 50.8,132.33 X43.8
N$281
  Top 0.61: IC10.9 41.89,129.56 39.37,132.08 X44.1
N$282
  Top 0.406: IC10.10 41.02,126.36 40.39,127 40.39,128.02 39.88,128.52
  Top 0.61: 39.88,128.52 39.37,128.52 X44.2
N$283
  Top 0.61: IC10.11 40.51,125.09 39.12,126.49 38.86,126.49 X44.3
N$284
  Top 0.61: IC10.12 39.75,123.83 39.12,124.46 X44.4
N$285
  Top 0.61: IC10.13 39.75,122.55 39.12,121.92 X44.5
N$286
  Top 0.61: IC10.14 40.51,121.28 38.86,119.63 38.61,119.63 X44.6
N$287
  Top 0.406: IC10.15 40.77,120.02 40.39,119.63 40.39,117.86 39.37,116.84 X44.7
N$288
  Top 0.61: IC10.16 41.89,116.81 39.37,114.3 X44.8
N$289
  Top 1.016: X45.1 62.97,132.33 Q25.1
N$290
  Top 1.016: X45.2 Q25.2
N$291
  Top 1.016: X45.3 62.97,127.25 Q25.3
N$292
  Top 1.016: X46.1 62.92,121.92 Q26.1
N$293
  Top 1.016: X46.2 62.69,119.38 Q26.2
N$294
  Top 1.016: X46.3 62.46,116.84 Q26.3
N$295
  Top 1.016: X46.4 63.8,114.3 Q26.4
N$296
  Top 1.016: X47.1 73.41,117.71 Q27.B
N$297
  Top 1.016: X47.2 75.95,117.71 Q27.E
N$298
  Top 1.016: Q27.C 77.39,120.23 78.23,119.38 78.23,114.55 X47.3
N$299
  Top 1.016: X48.1 88.57,132.33 Q28.1
N$300
  Top 1.016: X48.2 88.34,129.79 Q28.2
N$301
  Top 1.016: X48.3 88.11,127.25 Q28.3
N$302
  Top 1.016: X49.1 88.57,121.92 Q29.1
N$303
  Top 1.016: X49.2 88.34,119.38 Q29.2
N$304
  Top 1.016: X49.3 89.15,116.84 89.41,117.09 88.82,117.09 Q29.3
N$305
  Top 1.016: X49.4 90.93,114.3 94.23,117.6 94.23,119.08 Q29.4
N$306
  Top 1.016: X50.1 73.41,128.88 Q30.B
N$307
  Top 1.016: X50.2 75.95,129.39 Q30.E
N$308
  Top 1.016: X50.3 78.49,130.05 76.96,131.57 75.01,131.57 Q30.C
N$309
  Top 0.61: IC11.2 12.07,141.86 11.68,141.48 7.11,141.48 6.6,140.97 6.6,139.7 X51.2
N$310
  Top 0.61: IC11.1 6.15,143.31 3.81,140.97 X51.1
N$311
  Top 0.61: IC11.3 13.34,145.16 12.95,145.54 5.59,145.54 2.54,142.49 2.54,137.41 2.79,137.16 7.11,137.16 8.89,138.94 X51.3
N$312
  Top 0.61: IC11.4 14.61,141.61 14.48,141.48 13.21,141.48 12.7,140.97 12.7,140.72 X51.4
N$313
  Top 0.61: IC11.5 15.88,141.35 X51.5
N$314
  Top 0.61: IC11.6 17.14,140.08 X51.6
N$315
  Top 0.61: IC11.7 18.41,140.08 X51.7
N$316
  Top 0.61: IC11.8 19.68,141.35 X51.8
N$317
  Top 0.61: IC11.9 20.95,141.86 21.34,141.48 22.35,141.48 23.88,139.95 23.88,139.7 X51.9
N$318
  Top 0.61: IC11.10 22.22,144.91 22.86,145.54 29.72,145.54 33.27,141.99 33.27,137.92 32.51,137.16 27.69,137.16 26.92,137.92 26.92,139.19 X51.10
N$319
  Top 0.61: IC11.11 23.49,142.11 24.13,141.48 28.45,141.48 28.96,140.97 28.96,139.7 X51.11
N$320
  Top 0.61: IC11.16 20.95,154.31 21.59,154.94 22.35,154.94 23.88,156.46 23.88,156.97 X52.4
N$321
  Top 0.61: IC11.17 19.68,155.07 21.34,156.72 21.34,156.97 X52.5
N$322
  Top 0.61: IC11.18 18.29,153.37 18.29,155.45 19.05,156.21 X52.6
N$323
  Top 0.61: IC11.19 17.14,155.58 16.51,156.21 X52.7
N$324
  Top 0.61: IC11.20 15.88,155.07 14.48,156.46 14.48,156.72 X52.8
N$325
  Top 0.61: IC11.21 14.61,154.56 14.22,154.94 13.46,154.94 12.19,156.21 12.19,156.46 X52.9
N$326
  Top 0.61: IC11.22 13.34,151.77 12.7,151.13 6.35,151.13 2.29,155.19 2.29,158.75 3.3,159.77 8.38,159.77 9.14,159 9.14,157.48 X52.10
N$327
  Top 0.61: IC11.23 12.07,154.56 11.68,154.94 7.87,154.94 6.6,156.21 6.6,156.97 X52.11
N$328
  Top 0.61: IC11.12 29.92,143.31 31.75,141.48 X51.12
N$329
  Top 0.61: IC11.24 6.91,153.37 4.06,156.21 4.06,156.97 X52.12
N$330
  Top 0.61: IC11.15 22.22,152.02 23.11,151.13 28.96,151.13 33.27,155.45 33.27,158.75 32.51,159.51 27.43,159.51 26.67,158.75 X52.3
N$331
  Top 0.61: IC11.14 23.49,154.31 24.13,154.94 27.69,154.94 29.21,156.46 X52.2
N$332
  Top 0.61: IC11.13 28.9,153.37 31.75,156.21 X52.1
N$333
  Top 0.61: IC12.1 48.03,141.71 50.04,139.7 50.8,139.7 X53.1
N$334
  Top 0.61: X53.2 51.31,141.99 53.09,140.21 53.09,138.43 52.32,137.67 49.53,137.67 45.47,141.73 45.47,145.03 45.72,145.29 47.9,145.29 IC12.2
N$335
  Top 0.61: IC12.3 49.15,146.43 X53.3
N$336
  Top 0.61: IC12.4 49.4,147.7 49.53,147.57 50.55,147.57 X53.4
N$337
  Top 0.61: IC12.5 49.4,148.97 50.04,149.61 X53.5
N$338
  Top 0.61: IC12.6 49.15,150.24 X53.6
N$339
  Top 0.61: X53.7 51.56,154.69 53.09,156.21 53.09,157.73 52.07,158.75 49.78,158.75 45.21,154.18 45.21,152.65 46.23,151.64 47.9,151.64 IC12.7
N$340
  Top 0.61: IC12.8 48.03,155.22 50.29,157.48 50.8,157.48 X53.8
N$341
  Top 0.61: IC12.9 41.89,154.71 39.37,157.23 X54.1
N$342
  Top 0.406: IC12.10 41.02,151.51 40.39,152.15 40.39,153.16 39.88,153.67
  Top 0.61: 39.88,153.67 39.37,153.67 X54.2
N$343
  Top 0.61: IC12.11 40.51,150.24 39.12,151.64 38.86,151.64 X54.3
N$344
  Top 0.61: IC12.12 39.75,148.97 39.12,149.61 X54.4
N$345
  Top 0.61: IC12.13 39.75,147.7 39.12,147.07 X54.5
N$346
  Top 0.61: IC12.14 40.51,146.43 38.86,144.78 38.61,144.78 X54.6
N$347
  Top 0.406: IC12.15 40.77,145.16 40.39,144.78 40.39,143 39.37,141.99 X54.7
N$348
  Top 0.61: IC12.16 41.89,141.96 39.37,139.45 X54.8
N$349
  Top 1.016: X55.1 62.97,157.48 Q31.1
N$350
  Top 1.016: X55.2 Q31.2
N$351
  Top 1.016: X55.3 62.97,152.4 Q31.3
N$352
  Top 1.016: X56.1 62.92,147.07 Q32.1
N$353
  Top 1.016: X56.2 62.69,144.53 Q32.2
N$354
  Top 1.016: X56.3 62.46,141.99 Q32.3
N$355
  Top 1.016: X56.4 63.8,139.45 Q32.4
N$356
  Top 1.016: X57.1 73.41,142.85 Q33.B
N$357
  Top 1.016: X57.2 75.95,142.85 Q33.E
N$358
  Top 1.016: Q33.C 77.39,145.37 78.23,144.53 78.23,139.7 X57.3
N$359
  Top 1.016: X58.1 88.57,157.48 Q34.1
N$360
  Top 1.016: X58.2 88.34,154.94 Q34.2
N$361
  Top 1.016: X58.3 88.11,152.4 Q34.3
N$362
  Top 1.016: X59.1 88.57,147.07 Q35.1
N$363
  Top 1.016: X59.2 88.34,144.53 Q35.2
N$364
  Top 1.016: X59.3 89.15,141.99 89.41,142.24 88.82,142.24 Q35.3
N$365
  Top 1.016: X59.4 90.93,139.45 94.23,142.75 94.23,144.22 Q35.4
N$366
  Top 1.016: X60.1 73.41,154.03 Q36.B
N$367
  Top 1.016: X60.2 75.95,154.54 Q36.E
N$368
  Top 1.016: X60.3 78.49,155.19 76.96,156.72 75.01,156.72 Q36.C
N$369
  Top 0.61: IC13.2 12.07,168.78 11.68,168.4 7.11,168.4 6.6,167.89 6.6,166.62 X61.2
N$370
  Top 0.61: IC13.1 6.15,170.23 3.81,167.89 X61.1
N$371
  Top 0.61: IC13.3 13.34,172.09 12.95,172.47 5.59,172.47 2.54,169.42 2.54,164.34 2.79,164.08 7.11,164.08 8.89,165.86 X61.3
N$372
  Top 0.61: IC13.4 14.61,168.53 14.48,168.4 13.21,168.4 12.7,167.89 12.7,167.64 X61.4
N$373
  Top 0.61: IC13.5 15.88,168.28 X61.5
N$374
  Top 0.61: IC13.6 17.14,167.01 X61.6
N$375
  Top 0.61: IC13.7 18.41,167.01 X61.7
N$376
  Top 0.61: IC13.8 19.68,168.28 X61.8
N$377
  Top 0.61: IC13.9 20.95,168.78 21.34,168.4 22.35,168.4 23.88,166.88 23.88,166.62 X61.9
N$378
  Top 0.61: IC13.10 22.22,171.83 22.86,172.47 29.72,172.47 33.27,168.91 33.27,164.85 32.51,164.08 27.69,164.08 26.92,164.85 26.92,166.12 X61.10
N$379
  Top 0.61: IC13.11 23.49,169.04 24.13,168.4 28.45,168.4 28.96,167.89 28.96,166.62 X61.11
N$380
  Top 0.61: IC13.16 20.95,181.23 21.59,181.86 22.35,181.86 23.88,183.39 23.88,183.9 X62.4
N$381
  Top 0.61: IC13.17 19.68,181.99 21.34,183.64 21.34,183.9 X62.5
N$382
  Top 0.61: IC13.18 18.29,180.29 18.29,182.37 19.05,183.13 X62.6
N$383
  Top 0.61: IC13.19 17.14,182.5 16.51,183.13 X62.7
N$384
  Top 0.61: IC13.20 15.88,181.99 14.48,183.39 14.48,183.64 X62.8
N$385
  Top 0.61: IC13.21 14.61,181.48 14.22,181.86 13.46,181.86 12.19,183.13 12.19,183.39 X62.9
N$386
  Top 0.61: IC13.22 13.34,178.69 12.7,178.05 6.35,178.05 2.29,182.12 2.29,185.67 3.3,186.69 8.38,186.69 9.14,185.93 9.14,184.4 X62.10
N$387
  Top 0.61: IC13.23 12.07,181.48 11.68,181.86 7.87,181.86 6.6,183.13 6.6,183.9 X62.11
N$388
  Top 0.61: IC13.12 29.92,170.23 31.75,168.4 X61.12
N$389
  Top 0.61: IC13.24 6.91,180.29 4.06,183.13 4.06,183.9 X62.12
N$390
  Top 0.61: IC13.15 22.22,178.94 23.11,178.05 28.96,178.05 33.27,182.37 33.27,185.67 32.51,186.44 27.43,186.44 26.67,185.67 X62.3
N$391
  Top 0.61: IC13.14 23.49,181.23 24.13,181.86 27.69,181.86 29.21,183.39 X62.2
N$392
  Top 0.61: IC13.13 28.9,180.29 31.75,183.13 X62.1
N$393
  Top 0.61: IC14.1 48.03,168.63 50.04,166.62 50.8,166.62 X63.1
N$394
  Top 0.61: X63.2 51.31,168.91 53.09,167.13 53.09,165.35 52.32,164.59 49.53,164.59 45.47,168.66 45.47,171.96 45.72,172.21 47.9,172.21 IC14.2
N$395
  Top 0.61: IC14.3 49.15,173.36 X63.3
N$396
  Top 0.61: IC14.4 49.4,174.62 49.53,174.5 50.55,174.5 X63.4
N$397
  Top 0.61: IC14.5 49.4,175.9 50.04,176.53 X63.5
N$398
  Top 0.61: IC14.6 49.15,177.17 X63.6
N$399
  Top 0.61: X63.7 51.56,181.61 53.09,183.13 53.09,184.66 52.07,185.67 49.78,185.67 45.21,181.1 45.21,179.58 46.23,178.56 47.9,178.56 IC14.7
N$400
  Top 0.61: IC14.8 48.03,182.14 50.29,184.4 50.8,184.4 X63.8
N$401
  Top 0.61: IC14.9 41.89,181.64 39.37,184.15 X64.1
N$402
  Top 0.406: IC14.10 41.02,178.44 40.39,179.07 40.39,180.09 39.88,180.59
  Top 0.61: 39.88,180.59 39.37,180.59 X64.2
N$403
  Top 0.61: IC14.11 40.51,177.17 39.12,178.56 38.86,178.56 X64.3
N$404
  Top 0.61: IC14.12 39.75,175.9 39.12,176.53 X64.4
N$405
  Top 0.61: IC14.13 39.75,174.62 39.12,173.99 X64.5
N$406
  Top 0.61: IC14.14 40.51,173.36 38.86,171.7 38.61,171.7 X64.6
N$407
  Top 0.406: IC14.15 40.77,172.09 40.39,171.7 40.39,169.93 39.37,168.91 X64.7
N$408
  Top 0.61: IC14.16 41.89,168.89 39.37,166.37 X64.8
N$409
  Top 1.016: X65.1 62.97,184.4 Q37.1
N$410
  Top 1.016: X65.2 Q37.2
N$411
  Top 1.016: X65.3 62.97,179.32 Q37.3
N$412
  Top 1.016: X66.1 62.92,173.99 Q38.1
N$413
  Top 1.016: X66.2 62.69,171.45 Q38.2
N$414
  Top 1.016: X66.3 62.46,168.91 Q38.3
N$415
  Top 1.016: X66.4 63.8,166.37 Q38.4
N$416
  Top 1.016: X67.1 73.41,169.78 Q39.B
N$417
  Top 1.016: X67.2 75.95,169.78 Q39.E
N$418
  Top 1.016: Q39.C 77.39,172.3 78.23,171.45 78.23,166.62 X67.3
N$419
  Top 1.016: X68.1 88.57,184.4 Q40.1
N$420
  Top 1.016: X68.2 88.34,181.86 Q40.2
N$421
  Top 1.016: X68.3 88.11,179.32 Q40.3
N$422
  Top 1.016: X69.1 88.57,173.99 Q41.1
N$423
  Top 1.016: X69.2 88.34,171.45 Q41.2
N$424
  Top 1.016: X69.3 89.15,168.91 89.41,169.16 88.82,169.16 Q41.3
N$425
  Top 1.016: X69.4 90.93,166.37 94.23,169.67 94.23,171.15 Q41.4
N$426
  Top 1.016: X70.1 73.41,180.95 Q42.B
N$427
  Top 1.016: X70.2 75.95,181.46 Q42.E
N$428
  Top 1.016: X70.3 78.49,182.12 76.96,183.64 75.01,183.64 Q42.C
N$429
  Top 0.61: IC15.2 12.07,193.93 11.68,193.55 7.11,193.55 6.6,193.04 6.6,191.77 X71.2
N$430
  Top 0.61: IC15.1 6.15,195.38 3.81,193.04 X71.1
N$431
  Top 0.61: IC15.3 13.34,197.23 12.95,197.61 5.59,197.61 2.54,194.56 2.54,189.48 2.79,189.23 7.11,189.23 8.89,191.01 X71.3
N$432
  Top 0.61: IC15.4 14.61,193.68 14.48,193.55 13.21,193.55 12.7,193.04 12.7,192.79 X71.4
N$433
  Top 0.61: IC15.5 15.88,193.42 X71.5
N$434
  Top 0.61: IC15.6 17.14,192.15 X71.6
N$435
  Top 0.61: IC15.7 18.41,192.15 X71.7
N$436
  Top 0.61: IC15.8 19.68,193.42 X71.8
N$437
  Top 0.61: IC15.9 20.95,193.93 21.34,193.55 22.35,193.55 23.88,192.02 23.88,191.77 X71.9
N$438
  Top 0.61: IC15.10 22.22,196.98 22.86,197.61 29.72,197.61 33.27,194.06 33.27,189.99 32.51,189.23 27.69,189.23 26.92,189.99 26.92,191.26 X71.10
N$439
  Top 0.61: IC15.11 23.49,194.18 24.13,193.55 28.45,193.55 28.96,193.04 28.96,191.77 X71.11
N$440
  Top 0.61: IC15.16 20.95,206.38 21.59,207.01 22.35,207.01 23.88,208.53 23.88,209.04 X72.4
N$441
  Top 0.61: IC15.17 19.68,207.14 21.34,208.79 21.34,209.04 X72.5
N$442
  Top 0.61: IC15.18 18.29,205.44 18.29,207.52 19.05,208.28 X72.6
N$443
  Top 0.61: IC15.19 17.14,207.65 16.51,208.28 X72.7
N$444
  Top 0.61: IC15.20 15.88,207.14 14.48,208.53 14.48,208.79 X72.8
N$445
  Top 0.61: IC15.21 14.61,206.63 14.22,207.01 13.46,207.01 12.19,208.28 12.19,208.53 X72.9
N$446
  Top 0.61: IC15.22 13.34,203.84 12.7,203.2 6.35,203.2 2.29,207.26 2.29,210.82 3.3,211.84 8.38,211.84 9.14,211.07 9.14,209.55 X72.10
N$447
  Top 0.61: IC15.23 12.07,206.63 11.68,207.01 7.87,207.01 6.6,208.28 6.6,209.04 X72.11
N$448
  Top 0.61: IC15.12 29.92,195.38 31.75,193.55 X71.12
N$449
  Top 0.61: IC15.24 6.91,205.44 4.06,208.28 4.06,209.04 X72.12
N$450
  Top 0.61: IC15.15 22.22,204.09 23.11,203.2 28.96,203.2 33.27,207.52 33.27,210.82 32.51,211.58 27.43,211.58 26.67,210.82 X72.3
N$451
  Top 0.61: IC15.14 23.49,206.38 24.13,207.01 27.69,207.01 29.21,208.53 X72.2
N$452
  Top 0.61: IC15.13 28.9,205.44 31.75,208.28 X72.1
N$453
  Top 0.61: IC16.1 48.03,193.78 50.04,191.77 50.8,191.77 X73.1
N$454
  Top 0.61: X73.2 51.31,194.06 53.09,192.28 53.09,190.5 52.32,189.74 49.53,189.74 45.47,193.8 45.47,197.1 45.72,197.36 47.9,197.36 IC16.2
N$455
  Top 0.61: IC16.3 49.15,198.5 X73.3
N$456
  Top 0.61: IC16.4 49.4,199.77 49.53,199.64 50.55,199.64 X73.4
N$457
  Top 0.61: IC16.5 49.4,201.04 50.04,201.68 X73.5
N$458
  Top 0.61: IC16.6 49.15,202.31 X73.6
N$459
  Top 0.61: X73.7 51.56,206.76 53.09,208.28 53.09,209.8 52.07,210.82 49.78,210.82 45.21,206.25 45.21,204.72 46.23,203.71 47.9,203.71 IC16.7
N$460
  Top 0.61: IC16.8 48.03,207.29 50.29,209.55 50.8,209.55 X73.8
N$461
  Top 0.61: IC16.9 41.89,206.78 39.37,209.3 X74.1
N$462
  Top 0.406: IC16.10 41.02,203.58 40.39,204.22 40.39,205.23 39.88,205.74
  Top 0.61: 39.88,205.74 39.37,205.74 X74.2
N$463
  Top 0.61: IC16.11 40.51,202.31 39.12,203.71 38.86,203.71 X74.3
N$464
  Top 0.61: IC16.12 39.75,201.04 39.12,201.68 X74.4
N$465
  Top 0.61: IC16.13 39.75,199.77 39.12,199.14 X74.5
N$466
  Top 0.61: IC16.14 40.51,198.5 38.86,196.85 38.61,196.85 X74.6
N$467
  Top 0.406: IC16.15 40.77,197.23 40.39,196.85 40.39,195.07 39.37,194.06 X74.7
N$468
  Top 0.61: IC16.16 41.89,194.03 39.37,191.52 X74.8
N$469
  Top 1.016: X75.1 62.97,209.55 Q43.1
N$470
  Top 1.016: X75.2 Q43.2
N$471
  Top 1.016: X75.3 62.97,204.47 Q43.3
N$472
  Top 1.016: X76.1 62.92,199.14 Q44.1
N$473
  Top 1.016: X76.2 62.69,196.6 Q44.2
N$474
  Top 1.016: X76.3 62.46,194.06 Q44.3
N$475
  Top 1.016: X76.4 63.8,191.52 Q44.4
N$476
  Top 1.016: X77.1 73.41,194.92 Q45.B
N$477
  Top 1.016: X77.2 75.95,194.92 Q45.E
N$478
  Top 1.016: Q45.C 77.39,197.44 78.23,196.6 78.23,191.77 X77.3
N$479
  Top 1.016: X78.1 88.57,209.55 Q46.1
N$480
  Top 1.016: X78.2 88.34,207.01 Q46.2
N$481
  Top 1.016: X78.3 88.11,204.47 Q46.3
N$482
  Top 1.016: X79.1 88.57,199.14 Q47.1
N$483
  Top 1.016: X79.2 88.34,196.6 Q47.2
N$484
  Top 1.016: X79.3 89.15,194.06 89.41,194.31 88.82,194.31 Q47.3
N$485
  Top 1.016: X79.4 90.93,191.52 94.23,194.82 94.23,196.29 Q47.4
N$486
  Top 1.016: X80.1 73.41,206.1 Q48.B
N$487
  Top 1.016: X80.2 75.95,206.61 Q48.E
N$488
  Top 1.016: X80.3 78.49,207.26 76.96,208.79 75.01,208.79 Q48.C
N$489
  Top 1.016: 63.75,129.79 69.09,129.79
N$490
  Top 1.016: 89.15,130.05 95,130.05
N$491
  Top 1.016: 63.75,154.94 69.09,154.94
N$492
  Top 1.016: 89.15,155.19 95,155.19
N$493
  Top 1.016: 63.75,181.86 69.09,181.86
N$494
  Top 1.016: 89.15,182.12 95,182.12
N$495
  Top 1.016: 63.75,207.01 69.09,207.01
N$496
  Top 1.016: 89.15,207.26 95,207.26